# EAGLE design a78-flashcart (EAGLE 7.0.0)
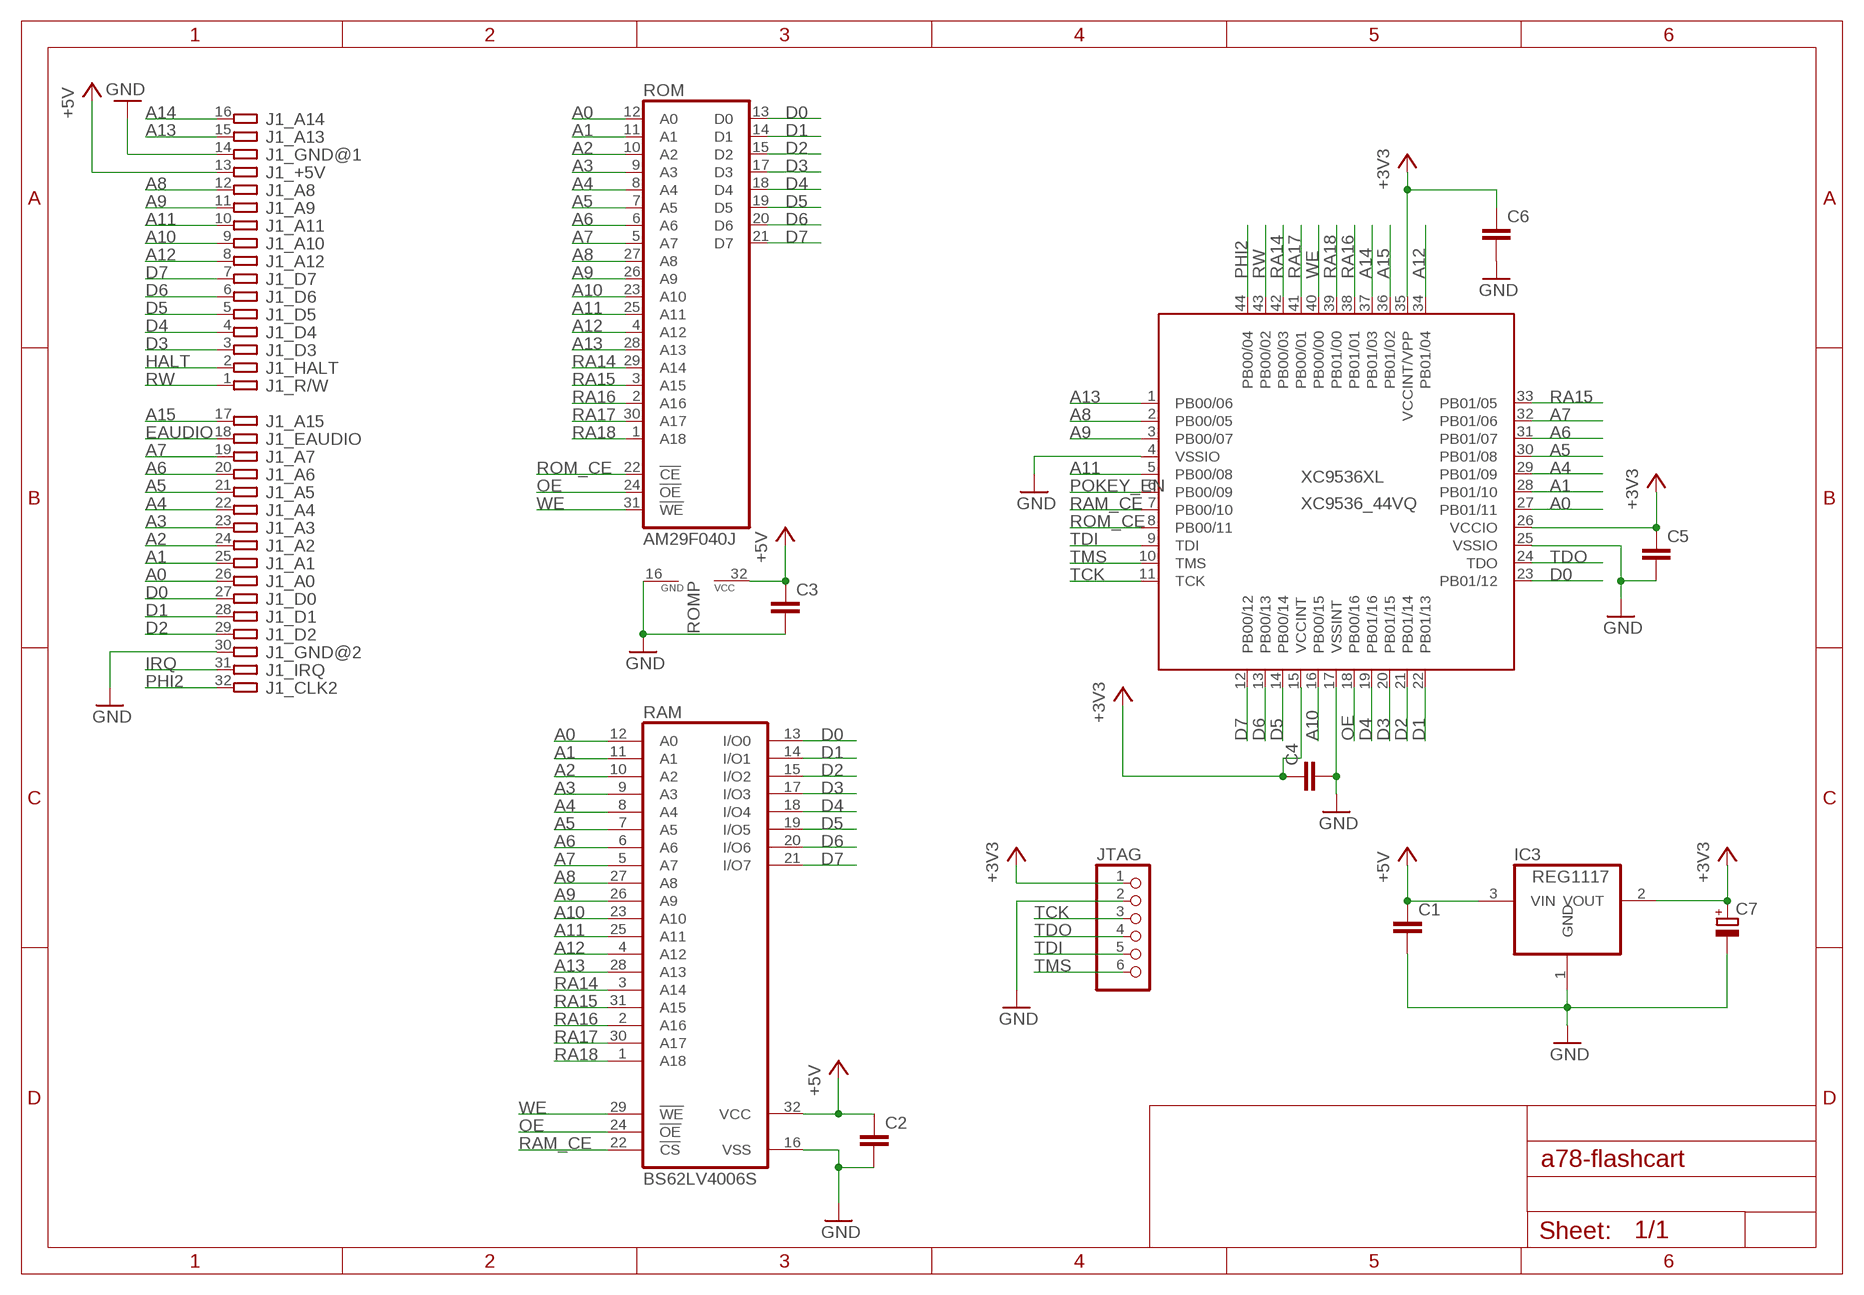
[diagram p0: schematic, sheet 1]

## Parts
C1  C-EUC0603  [C0603]
C2  C-EUC0603  [C0603]
C3  C-EUC0603  [C0603]
C4  C-EUC0603  [C0603]
C5  C-EUC0603  [C0603]
C6  C-EUC0603  [C0603]
C7  CPOL-EUSMCC  [SMC_C]
IC3  REG1117  [SOT223]
J1  ATARI-7800-SMALL  [ATARI-7800-SMALL]
JTAG  PINHD-1X6  [1X06]
RAM  BS62LV4006S  [SOP-32]
ROM  AM29F040J  [PLCC32R]
XC9536XL  XC9536_44VQ  [SQFP-S-10X10-44]

## Nets
+3V3: C4.1 C5.1 C6.1 C7.+ IC3.2(VOUT) JTAG.1 XC9536XL.15(VCCINT) XC9536XL.26(VCCIO) XC9536XL.35(VCCINT/VPP)
+5V: C1.1 C2.1 C3.1 IC3.3(VIN) J1.13 RAM.32(VCC) ROM.32(VCC)
A0: J1.26 RAM.12(A0) ROM.12(A0) XC9536XL.27(PB01/11)
A1: J1.25 RAM.11(A1) ROM.11(A1) XC9536XL.28(PB01/10)
A2: J1.24 RAM.10(A2) ROM.10(A2)
A3: J1.23 RAM.9(A3) ROM.9(A3)
A4: J1.22 RAM.8(A4) ROM.8(A4) XC9536XL.29(PB01/09)
A5: J1.21 RAM.7(A5) ROM.7(A5) XC9536XL.30(PB01/08)
A6: J1.20 RAM.6(A6) ROM.6(A6) XC9536XL.31(PB01/07)
A7: J1.19 RAM.5(A7) ROM.5(A7) XC9536XL.32(PB01/06)
A8: J1.12 RAM.27(A8) ROM.27(A8) XC9536XL.2(PB00/05)
A9: J1.11 RAM.26(A9) ROM.26(A9) XC9536XL.3(PB00/07)
A10: J1.9 RAM.23(A10) ROM.23(A10) XC9536XL.16(PB00/15)
A11: J1.10 RAM.25(A11) ROM.25(A11) XC9536XL.5(PB00/08)
A12: J1.8 RAM.4(A12) ROM.4(A12) XC9536XL.34(PB01/04)
A13: J1.15 RAM.28(A13) ROM.28(A13) XC9536XL.1(PB00/06)
A14: J1.16 XC9536XL.37(PB01/03)
A15: J1.17 XC9536XL.36(PB01/02)
D0: J1.27 RAM.13(I/O0) ROM.13(D0) XC9536XL.23(PB01/12)
D1: J1.28 RAM.14(I/O1) ROM.14(D1) XC9536XL.22(PB01/13)
D2: J1.29 RAM.15(I/O2) ROM.15(D2) XC9536XL.21(PB01/14)
D3: J1.3 RAM.17(I/O3) ROM.17(D3) XC9536XL.20(PB01/15)
D4: J1.4 RAM.18(I/O4) ROM.18(D4) XC9536XL.19(PB01/16)
D5: J1.5 RAM.19(I/O5) ROM.19(D5) XC9536XL.14(PB00/14)
D6: J1.6 RAM.20(I/O6) ROM.20(D6) XC9536XL.13(PB00/13)
D7: J1.7 RAM.21(I/O7) ROM.21(D7) XC9536XL.12(PB00/12)
EAUDIO: J1.18
GND: C1.2 C2.2 C3.2 C4.2 C5.2 C6.2 C7.- IC3.1(GND) J1.14 J1.30 JTAG.2 RAM.16(VSS) ROM.16(GND) XC9536XL.4(VSSIO) XC9536XL.17(VSSINT) XC9536XL.25(VSSIO)
HALT: J1.2
IRQ: J1.31
OE: RAM.24(!OE) ROM.24(!OE) XC9536XL.18(PB00/16)
PHI2: J1.32 XC9536XL.44(PB00/04)
POKEY_EN: XC9536XL.6(PB00/09)
RA14: RAM.3(A14) ROM.29(A14) XC9536XL.42(PB00/03)
RA15: RAM.31(A15) ROM.3(A15) XC9536XL.33(PB01/05)
RA16: RAM.2(A16) ROM.2(A16) XC9536XL.38(PB01/01)
RA17: RAM.30(A17) ROM.30(A17) XC9536XL.41(PB00/01)
RA18: RAM.1(A18) ROM.1(A18) XC9536XL.39(PB01/00)
RAM_CE: RAM.22(!CS) XC9536XL.7(PB00/10)
ROM_CE: ROM.22(!CE) XC9536XL.8(PB00/11)
RW: J1.1 XC9536XL.43(PB00/02)
TCK: JTAG.3 XC9536XL.11(TCK)
TDI: JTAG.5 XC9536XL.9(TDI)
TDO: JTAG.4 XC9536XL.24(TDO)
TMS: JTAG.6 XC9536XL.10(TMS)
WE: RAM.29(!WE) ROM.31(!WE) XC9536XL.40(PB00/00)

## Library data of the parts
C1-C6 = resistor:C-EU: CAPACITOR, European symbol
C7 = resistor:CPOL-EU: POLARIZED CAPACITOR, European symbol
IC3 = burr-brown:REG1117: 800mA and 1A Low Dropout (LDO) Positive Regulator 1.8V, 2.5V, 2.85V, 3.3V, 5V, and Adj; MPN: REG1117; OC_FARNELL: 1097566; OC_NEWARK: 14P6981
J1 = atari-7800-tdi:ATARI-7800: Atari 7800 cartridge board
JTAG = adafruit:PINHD-1X6: PIN HEADER
RAM = memory-bsi:BS62LV4006
ROM = am29-memory:AM29F040J: 4-Megabit FLASH MEMORY (512 K x 8 bit) 5 V-only
XC9536XL = xilinx-xc9:XC9536_44VQ: xc9536_pc44 XC9500 In-System Programmable CPLD Family Auto generated by make-symbol-device-package-bsdl.ulp Rev. 34 Source: xc9536_vq44.bsd; MPN: XC9536-15VQG44C; OC_FARNELL: 1193227; OC_NEWARK: 98K3377

## Board
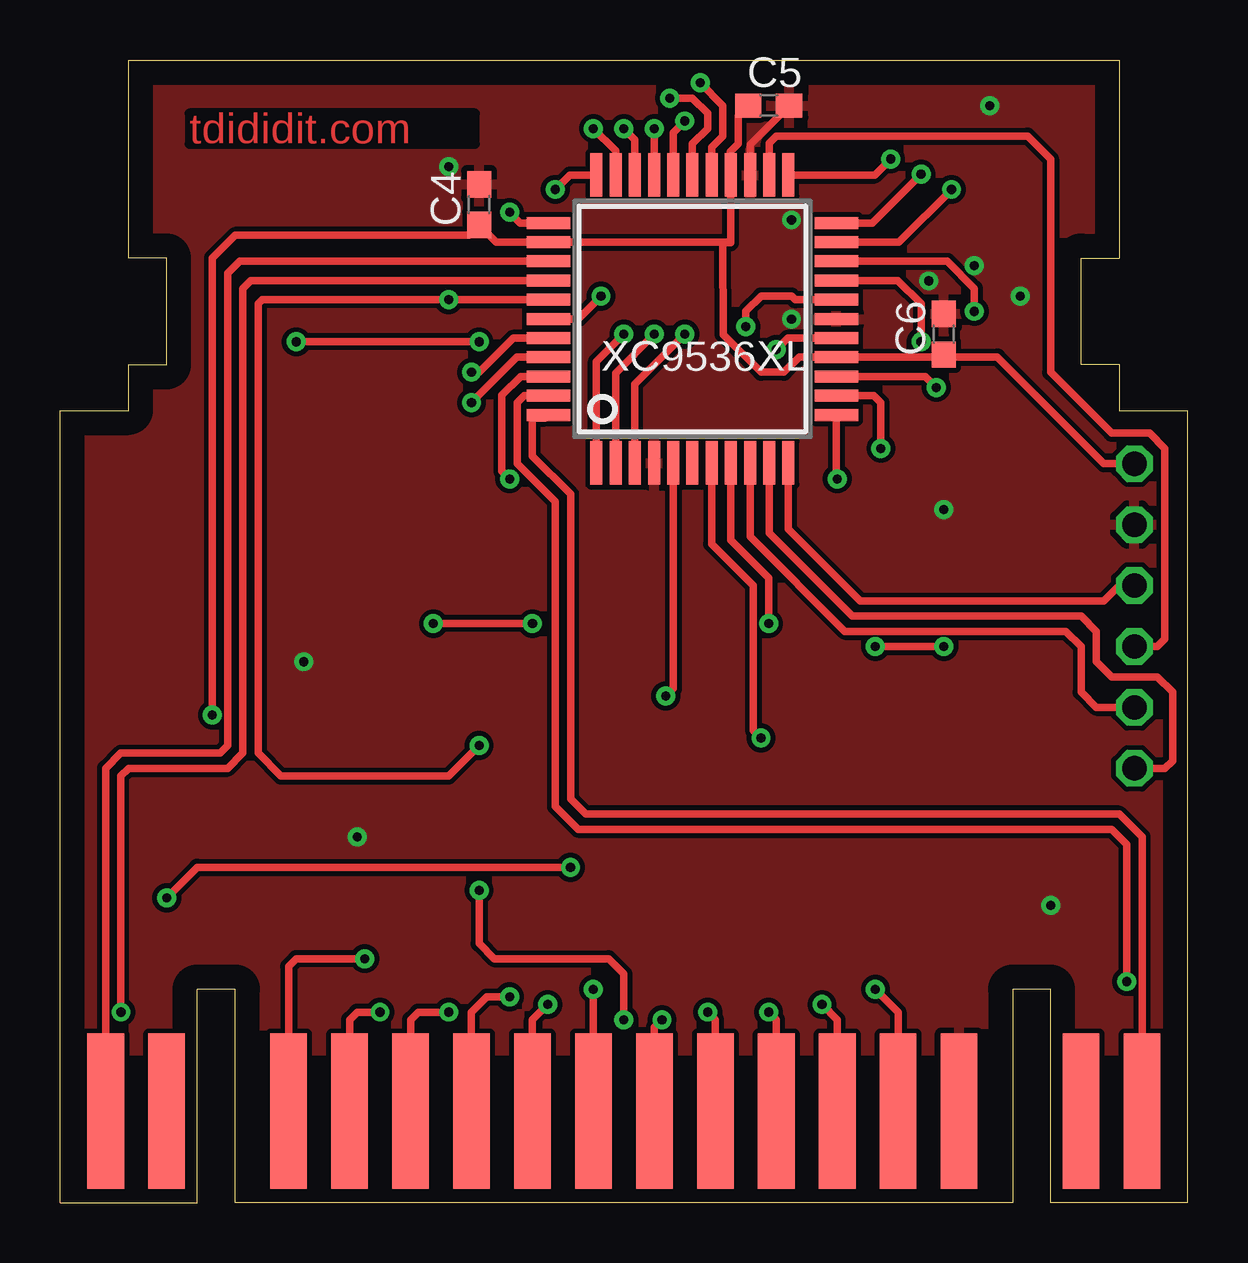
[diagram p1: board, top side]
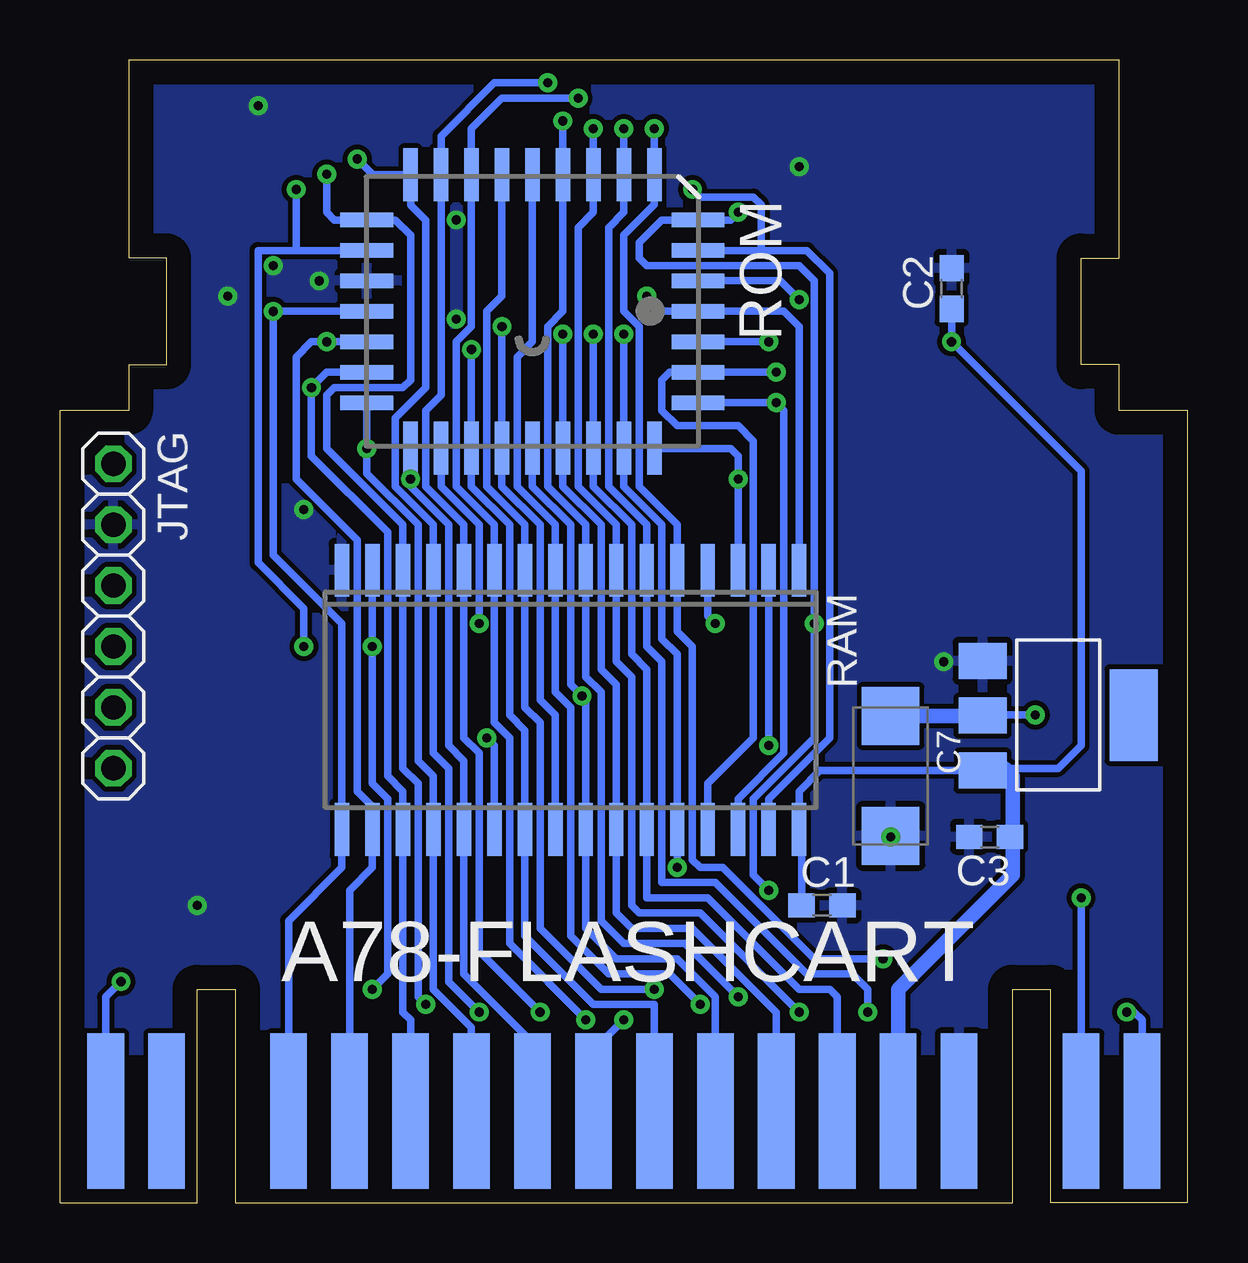
[diagram p2: board, bottom side, seen from below]

Size 46.99 x 47.62 mm. Coordinates in mm from the lower left corner, seen from the top.
Copper layers (1*16): Top 0.035mm / dielectric 1.5mm / Bottom 0.035mm
Design rules "default": minimum track width 10mil, minimum drill 24mil, track to track 8mil, track to pad 8mil, pad to pad 8mil, via to via 8mil, smd to smd 8mil, copper to edge 40mil, drill to drill 8mil, minimum pad ring 10mil, minimum via ring 8mil, stop-mask expansion 4mil, vias tented up to drill 0mil, thermal gap 10mil

### Footprints (pad centres in the part's own frame; a part is rotated, then mirrored left to right if it is on the bottom)
C0603 = smd 1.1 x 1: 1 -0.85,0; 2 0.85,0
SMC_C = smd 2.4 x 2.4: + -2.5,0; - 2.5,0
SOT223 = smd 1.499 x 2.007: 1 -2.261,-3.15; 2 0.025,-3.15; 3 2.311,-3.15 | smd 3.81 x 2.007: 4 0,3.15
ATARI-7800-SMALL = smd 1.524 x 6.477: 1 -21.59,3.81; 2 -19.05,3.81; 3 -13.97,3.81; 4 -11.43,3.81; 5 -8.89,3.81; 6 -6.35,3.81; 7 -3.81,3.81; 8 -1.27,3.81; 9 1.27,3.81; 10 3.81,3.81; 11 6.35,3.81; 12 8.89,3.81; 13 11.43,3.81; 14 13.97,3.81; 15 19.05,3.81; 16 21.59,3.81 | smd 1.524 x 6.477 bottom: 17 21.59,3.81; 18 19.05,3.81; 19 13.97,3.81; 20 11.43,3.81; 21 8.89,3.81; 22 6.35,3.81; 23 3.81,3.81; 24 1.27,3.81; 25 -1.27,3.81; 26 -3.81,3.81; 27 -6.35,3.81; 28 -8.89,3.81; 29 -11.43,3.81; 30 -13.97,3.81; 31 -19.05,3.81; 32 -21.59,3.81
1X06 = drill 1.016 octagon: 1 -6.35,0; 2 -3.81,0; 3 -1.27,0; 4 1.27,0; 5 3.81,0; 6 6.35,0
SOP-32 = smd 0.6 x 2.2: 1 -9.525,-5.4; 2 -8.255,-5.4; 3 -6.985,-5.4; 4 -5.715,-5.4; 5 -4.445,-5.4; 6 -3.175,-5.4; 7 -1.905,-5.4; 8 -0.635,-5.4; 9 0.635,-5.4; 10 1.905,-5.4; 11 3.175,-5.4; 12 4.445,-5.4; 13 5.715,-5.4; 14 6.985,-5.4; 15 8.255,-5.4; 16 9.525,-5.4; 17 9.525,5.4; 18 8.255,5.4; 19 6.985,5.4; 20 5.715,5.4; 21 4.445,5.4; 22 3.175,5.4; 23 1.905,5.4; 24 0.635,5.4; 25 -0.635,5.4; 26 -1.905,5.4; 27 -3.175,5.4; 28 -4.445,5.4; 29 -5.715,5.4; 30 -6.985,5.4; 31 -8.255,5.4; 32 -9.525,5.4
PLCC32R = smd 0.6 x 2.2: 1 0,6.9; 2 -1.27,6.9; 3 -2.54,6.9; 4 -3.81,6.9; 14 -3.81,-6.9; 15 -2.54,-6.9; 16 -1.27,-6.9; 17 0,-6.9; 18 1.27,-6.9; 19 2.54,-6.9; 20 3.81,-6.9; 30 3.81,6.9; 31 2.54,6.9; 32 1.27,6.9 | smd 2.2 x 0.6: 5 -5.7,5.08; 6 -5.7,3.81; 7 -5.7,2.54; 8 -5.7,1.27; 9 -5.7,0; 10 -5.7,-1.27; 11 -5.7,-2.54; 12 -5.7,-3.81; 13 -5.7,-5.08; 21 5.7,-5.08; 22 5.7,-3.81; 23 5.7,-2.54; 24 5.7,-1.27; 25 5.7,0; 26 5.7,1.27; 27 5.7,2.54; 28 5.7,3.81; 29 5.7,5.08
SQFP-S-10X10-44 = smd 0.5 x 1.8: 1 -4,-6; 2 -3.2,-6; 3 -2.4,-6; 4 -1.6,-6; 5 -0.8,-6; 6 0,-6; 7 0.8,-6; 8 1.6,-6; 9 2.4,-6; 10 3.2,-6; 11 4,-6; 23 4,6; 24 3.2,6; 25 2.4,6; 26 1.6,6; 27 0.8,6; 28 0,6; 29 -0.8,6; 30 -1.6,6; 31 -2.4,6; 32 -3.2,6; 33 -4,6 | smd 1.8 x 0.5: 12 6,-4; 13 6,-3.2; 14 6,-2.4; 15 6,-1.6; 16 6,-0.8; 17 6,0; 18 6,0.8; 19 6,1.6; 20 6,2.4; 21 6,3.2; 22 6,4; 34 -6,4; 35 -6,3.2; 36 -6,2.4; 37 -6,1.6; 38 -6,0.8; 39 -6,0; 40 -6,-0.8; 41 -6,-1.6; 42 -6,-2.4; 43 -6,-3.2; 44 -6,-4

### Placement (x,y rotation side)
C1  15.24,12.38 0 bottom
C2  9.84,38.1 90 bottom
C3  8.26,15.24 180 bottom
C4  17.46,41.59 90 top
C5  29.53,45.72 0 top
C6  36.83,36.2 90 top
C7  12.38,17.78 270 bottom
IC3  5.4,20.32 270 bottom
J1  23.5,0 0 bottom
JTAG  44.77,24.45 270 bottom
RAM  25.72,20.95 180 bottom
ROM  27.3,37.15 270 bottom
XC9536XL  26.35,36.83 0 top

### Tracks (layer width: path | path; a pad name or v marks a point on that pad's centre or on a via)
+3V3  (via drill 0.38)
  Top 0.305: JTAG.1 43.5,30.8 39.05,35.24 36.93,35.24 C6.1 36.71,35.23 XC9536XL.15 32.34,35.24 30.8,35.24 30.16,34.61 29.21,34.61 27.64,36.18 27.62,40.01 27.94,40.01 | 27.94,40.01 27.92,40.03 XC9536XL.35 18.17,40.03 C4.1 17.04,40.32 7.3,40.32 6.35,39.37 v6.35,20.32 | 27.94,40.01 27.94,42.82 XC9536XL.26 27.93,43.59 27.93,43.8 28.26,44.13 28.26,45.3 C5.1
  Bottom 0.305: v6.35,20.32 8.52,20.32 IC3.2
  Bottom 0.61: C7.+ 8.56,20.28 IC3.2
+5V  (via drill 0.38)
  Top 0.305: v17.46,35.88 v9.84,35.88
  Bottom 0.305: IC3.3 15.33,18.01 16.19,17.15 RAM.32 16.09,15.45 C1.1 | ROM.32 v17.46,35.88 | C2.1 v9.84,35.88 4.45,30.48 4.45,19.05 5.4,18.1 7.62,18.1
  Bottom 0.61: J1.13 12.07,8.89 7.3,13.65 7.3,15.24 | 7.3,15.24 7.3,17.78 7.62,18.1 8.46,18.1 IC3.3 | C3.1 7.3,15.24
A0  (via drill 0.38)
  Top 0.305: J1.26 27.3,7.62 v26.99,7.94 | XC9536XL.27 27.15,43.98 27.62,44.45 27.62,45.72 v26.67,46.67
  Bottom 0.305: v26.99,7.94 29.53,10.48 29.53,18.73 30.16,19.37 RAM.12 30.16,28.26 31.75,29.84 31.75,33.02 31.12,33.66 ROM.12 31.12,44.45 28.89,46.67 v26.67,46.67
A1  (via drill 0.38)
  Top 0.305: J1.25 24.76,7.3 v25.08,7.62 | XC9536XL.28 26.35,44.13 26.99,44.77 26.99,45.4 26.35,46.04 v25.4,46.04
  Bottom 0.305: v25.08,7.62 28.26,10.8 28.26,19.37 28.89,20 RAM.11 28.89,28.26 30.48,29.84 30.48,35.88 29.85,36.51 ROM.11 29.85,44.77 28.57,46.04 v25.4,46.04
A2  (via drill 0.38)
  Top 0.305: v22.23,8.89 J1.24
  Bottom 0.305: ROM.10 28.57,37.78 29.21,37.15 29.21,29.84 27.62,28.26 RAM.10 27.62,20.64 26.99,20 26.99,11.43 24.45,8.89 v22.23,8.89
A3  (via drill 0.38)
  Top 0.305: J1.23 19.69,7.62 v20.32,8.25
  Bottom 0.305: ROM.9 27.3,35.88 27.94,35.24 27.94,29.84 26.35,28.26 RAM.9 26.35,21.27 25.72,20.64 25.72,11.11 24.13,9.52 21.59,9.52 v20.32,8.25
A4  (via drill 0.38)
  Top 0.305: J1.22 17.14,7.94 17.78,8.57 v18.73,8.57 | XC9536XL.29 25.55,44.6 v26.03,45.09
  Bottom 0.305: v18.73,8.57 20.96,10.8 23.49,10.8 24.45,11.75 24.45,21.27 25.08,21.91 RAM.8 25.08,28.26 26.67,29.84 26.67,36.51 26.03,37.15 ROM.8 v26.03,45.09
A5  (via drill 0.38)
  Top 0.305: v16.19,7.94 14.92,7.94 14.6,7.62 J1.21 | v24.76,44.77 ROM.7 XC9536XL.30
  Bottom 0.305: v16.19,7.94 20.32,12.07 22.86,12.07 23.18,12.38 23.18,21.91 23.81,22.54 RAM.7 23.81,28.26 25.4,29.84 25.4,40.64 24.76,41.27 ROM.7 v24.76,44.77
A6  (via drill 0.38)
  Top 0.305: v13.33,7.94 12.38,7.94 12.07,7.62 J1.20 | XC9536XL.31 23.95,44.31 v23.49,44.77
  Bottom 0.305: v13.33,7.94 13.33,8.89 13.97,9.52 15.87,9.52 19.69,13.33 21.91,13.33 21.91,22.54 22.54,23.18 RAM.6 22.54,28.26 24.13,29.84 24.13,40.64 23.49,41.27 ROM.6 v23.49,44.77
A7  (via drill 0.38)
  Top 0.305: v12.7,10.16 9.84,10.16 9.52,9.84 J1.19 | XC9536XL.32 23.15,43.84 v22.23,44.77
  Bottom 0.305: v12.7,10.16 15.56,10.16 19.37,13.97 20.32,13.97 20.64,14.29 20.64,23.18 21.27,23.81 RAM.5 21.27,28.26 22.86,29.84 22.86,36.51 23.49,37.15 23.49,40.32 22.23,41.59 ROM.5 v22.23,44.77
A8  (via drill 0.38)
  Top 0.305: XC9536XL.2 23.15,34.58 v24.76,36.2
  Bottom 0.305: J1.12 14.6,8.57 14.92,8.89 16.19,8.89 20,12.7 22.54,12.7 RAM.27 22.54,22.22 23.18,22.86 23.18,28.26 24.76,29.84 ROM.27 v24.76,36.2
A9  (via drill 0.38)
  Top 0.305: XC9536XL.3 23.95,34.11 v26.03,36.2
  Bottom 0.305: J1.11 17.14,7.94 20.64,11.43 23.18,11.43 23.81,12.07 RAM.26 23.81,21.59 24.45,22.22 24.45,28.26 26.03,29.84 ROM.26 v26.03,36.2
A10  (via drill 0.38)
  Top 0.305: XC9536XL.16 30.32,36.03 v29.85,35.56
  Bottom 0.305: J1.9 22.23,8.25 24.76,8.25 27.62,11.11 RAM.23 27.62,19.68 28.26,20.32 28.26,28.26 29.85,29.84 ROM.23 v29.85,35.56
A11  (via drill 0.38)
  Top 0.305: XC9536XL.5 25.55,21.43 v25.24,21.11
  Bottom 0.305: ROM.25 27.3,29.84 25.72,28.26 25.72,21.59 v25.24,21.11 25.08,20.95 RAM.25 25.08,11.43 23.81,10.16 21.27,10.16 19.69,8.57 J1.10
A12  (via drill 0.38)
  Top 0.305: v17.46,13.02 17.46,10.8 18.1,10.16 22.86,10.16 23.49,9.52 v23.49,7.62 | v19.69,24.13 v15.56,24.13 | XC9536XL.34 19.18,40.83 v18.73,41.27
  Bottom 0.305: v17.46,13.02 18.1,13.65 18.1,16.83 15.56,19.37 v15.56,24.13 15.56,38.42 16.19,39.05 22.54,39.05 22.86,39.37 22.86,40.01 21.91,40.96 ROM.4 19.05,40.96 v18.73,41.27 | v23.49,7.62 24.76,6.35 J1.8 | RAM.4 20,24.45 v19.69,24.13
A13  (via drill 0.38)
  Top 0.305: v4.45,12.7 5.71,13.97 v21.27,13.97 | XC9536XL.1 22.35,35.05 v23.49,36.2
  Bottom 0.305: J1.15 v4.45,12.7 | v21.27,13.97 RAM.28 21.27,22.86 21.91,23.5 21.91,28.26 23.49,29.84 ROM.28 v23.49,36.2
A14  (via drill 0.38)
  Top 0.305: v2.54,7.94 2.54,17.78 2.86,18.1 6.99,18.1 7.62,18.73 7.62,38.1 7.95,38.43 XC9536XL.37
  Bottom 0.305: J1.16 1.91,7.62 2.22,7.94 v2.54,7.94
A15
  Top 0.305: J1.17 1.91,18.1 2.54,18.73 6.67,18.73 6.99,19.05 6.99,38.74 7.48,39.23 XC9536XL.36
D0  (via drill 0.38)
  Top 0.305: J1.27 29.85,7.62 v29.53,7.94 | XC9536XL.23 33.94,42.83 v34.61,43.5
  Bottom 0.305: v29.53,7.94 30.8,9.21 30.8,18.1 31.43,18.73 RAM.13 31.43,28.26 33.02,29.84 33.02,32.7 31.75,33.97 31.75,40.94 32.39,41.58 ROM.13 33.96,42.85 v34.61,43.5
D1  (via drill 0.38)
  Top 0.305: J1.28 32.39,7.62 v31.75,8.25 | XC9536XL.22 33.85,40.83 v35.88,42.86
  Bottom 0.305: v31.75,8.25 32.07,8.57 32.07,17.46 32.7,18.1 RAM.14 32.7,28.26 35.88,31.43 35.88,33.66 35.56,33.97 32.7,33.97 32.39,34.29 32.39,40.32 33.02,40.96 ROM.14 35.56,40.96 35.88,41.27 v35.88,42.86
D2  (via drill 0.38)
  Top 0.305: v33.97,8.89 34.92,7.94 J1.29 | XC9536XL.21 34.95,40.03 v37.15,42.23 | v33.97,23.18 v36.83,23.18
  Bottom 0.305: v33.97,8.89 33.34,9.52 33.34,16.83 33.97,17.46 v33.97,23.18 RAM.15 | v37.15,42.23 37.15,39.69 | v36.83,23.18 36.83,24.77 38.74,26.67 38.74,39.69 37.15,39.69 | 37.15,39.69 ROM.15
D3  (via drill 0.38)
  Top 0.305: XC9536XL.20 36.97,39.23 38.1,38.1 v38.1,37.15
  Bottom 0.305: J1.3 37.46,11.75 35.24,13.97 RAM.17 35.24,20 35.24,24.13 38.1,26.99 v38.1,37.15 ROM.17
D4  (via drill 0.38)
  Top 0.305: XC9536XL.19 34.91,38.43 35.88,37.46 v35.88,35.88
  Bottom 0.305: J1.4 34.92,13.02 33.97,13.97 RAM.18 33.97,16.51 34.61,17.15 34.61,27.62 37.15,30.16 37.15,35.24 36.51,35.88 v35.88,35.88 ROM.18
D5  (via drill 0.38)
  Top 0.305: XC9536XL.14 36.06,34.43 v36.51,33.97
  Bottom 0.305: J1.5 32.39,7.62 32.7,7.94 RAM.19 32.7,17.15 33.34,17.78 33.34,27.94 36.51,31.12 v36.51,33.97 35.88,34.61 ROM.19
D6  (via drill 0.38)
  Top 0.305: XC9536XL.13 33.91,33.63 ROM.20 v34.21,31.43
  Bottom 0.305: ROM.20 v34.21,31.43 34.21,30.4 32.07,28.26 32.07,18.41 31.43,17.78 RAM.20 31.43,8.89 29.85,7.3 J1.6
D7  (via drill 0.38)
  Top 0.305: XC9536XL.12 32.35,30.2 v32.39,30.16
  Bottom 0.305: J1.7 27.3,6.67 30.16,9.52 RAM.21 30.16,18.41 30.8,19.05 30.8,28.26 32.39,29.84 v32.39,30.16 ROM.21
GND  (via drill 0.38)
  Top 0.305: XC9536XL.25 28.75,44.09 C5.2
  other vias: 36.83,28.89 41.28,12.38 36.2,38.42 16.19,43.18 30.48,40.96 30.48,36.83 38.1,39.05 12.38,15.24 10.16,22.54 40,37.78 38.73,45.72
  pour Top (isolate 0.16): 46.36,6.35 46.36,48.26 -0.63,48.26 -0.63,6.35
  pour Bottom (isolate 0.16): 46.36,6.35 46.36,48.26 -0.63,48.26 -0.63,6.35
OE  (via drill 0.38)
  Top 0.305: v28.57,36.51 28.57,37.15 29.21,37.78 30.48,37.78 30.63,37.63 XC9536XL.18
  Bottom 0.305: RAM.24 26.35,20.32 26.99,20.95 26.99,28.26 28.57,29.84 ROM.24 v28.57,36.51
PHI2
  Top 0.305: J1.32 45.09,15.24 44.13,16.19 21.91,16.19 21.27,16.83 21.27,29.53 19.69,31.12 19.69,32.7 20.23,32.7 XC9536XL.44
RA14  (via drill 0.38)
  Top 0.305: XC9536XL.42 19.19,34.43 18.42,33.66 18.42,30.48 v18.73,30.16
  Bottom 0.305: RAM.3 v18.73,30.16 18.73,31.12 19.05,31.43 22.21,31.43 ROM.29
RA15  (via drill 0.38)
  Top 0.305: XC9536XL.33 21.24,42.83 v20.64,42.23
  Bottom 0.305: RAM.31 17.46,16.83 14.92,19.37 14.92,38.74 15.87,39.69 17.78,39.69 | 17.78,39.69 ROM.3 | v20.64,42.23 20.32,41.91 18.1,41.91 17.78,41.59 17.78,39.69
RA16  (via drill 0.38)
  Top 0.305: v17.46,19.05 16.19,17.78 9.21,17.78 8.25,18.73 8.25,37.46 8.42,37.63 v16.19,37.63 XC9536XL.38
  Bottom 0.305: v17.46,19.05 RAM.2 | ROM.2 16.98,38.42 v16.19,37.63
RA17  (via drill 0.38)
  Top 0.305: XC9536XL.41 19.04,35.23 v17.14,33.34
  Bottom 0.305: RAM.30 18.73,16.83 16.83,18.73 16.83,33.02 v17.14,33.34 ROM.30
RA18  (via drill 0.38)
  Top 0.305: XC9536XL.39 21.59,36.83 v22.54,37.78
  Bottom 0.305: RAM.1 16.19,36.51 16.83,37.15 ROM.1 21.91,37.15 v22.54,37.78
RAM_CE  (via drill 0.38)
  Top 0.305: XC9536XL.7 27.15,27.46 28.89,25.72 28.89,19.68 v29.21,19.37
  Bottom 0.305: v29.21,19.37 28.89,19.05 RAM.22
ROM_CE  (via drill 0.38)
  Top 0.305: XC9536XL.8 27.95,27.61 29.53,26.04 v29.53,24.13
  Bottom 0.305: v29.53,24.13 29.53,28.26 31.12,29.84 ROM.22
RW  (via drill 0.38)
  Top 0.305: XC9536XL.43 19.34,33.63 19.05,33.34 19.05,30.8 20.64,29.21 20.64,16.51 21.59,15.56 43.82,15.56 44.45,14.92 v44.45,9.21
  Bottom 0.305: v44.45,9.21 45.09,8.57 J1.1
TCK
  Top 0.305: XC9536XL.11 30.35,28.07 33.34,25.08 43.5,25.08 44.13,25.72 JTAG.3
TDI
  Top 0.305: XC9536XL.9 28.75,27.76 32.7,23.81 41.91,23.81 42.54,23.18 42.54,21.27 43.18,20.64 JTAG.5
TDO
  Top 0.305: XC9536XL.24 29.55,44.16 29.85,44.45 40.32,44.45 41.28,43.5 41.28,34.61 43.82,32.07 45.4,32.07 46.04,31.43 46.04,23.5 45.72,23.18 JTAG.4
TMS
  Top 0.305: XC9536XL.10 29.55,27.91 33.02,24.45 42.54,24.45 43.18,23.81 43.18,22.54 43.82,21.91 45.72,21.91 46.35,21.27 46.35,18.41 46.04,18.1 JTAG.6
WE  (via drill 0.38)
  Top 0.305: XC9536XL.40 18.89,36.03 17.46,34.61 v17.14,34.61
  Bottom 0.305: RAM.29 20,17.46 18.1,19.37 18.1,31.75 18.73,32.38 21.27,32.38 21.91,33.02 21.91,34.29 21.59,34.61 ROM.31 v17.14,34.61

### Text on the board
Top: tdididit.com
bPlace: A78-FLASHCART